# Altium schematic sheet 锁生活.SchDoc
size 381 x 241 mm
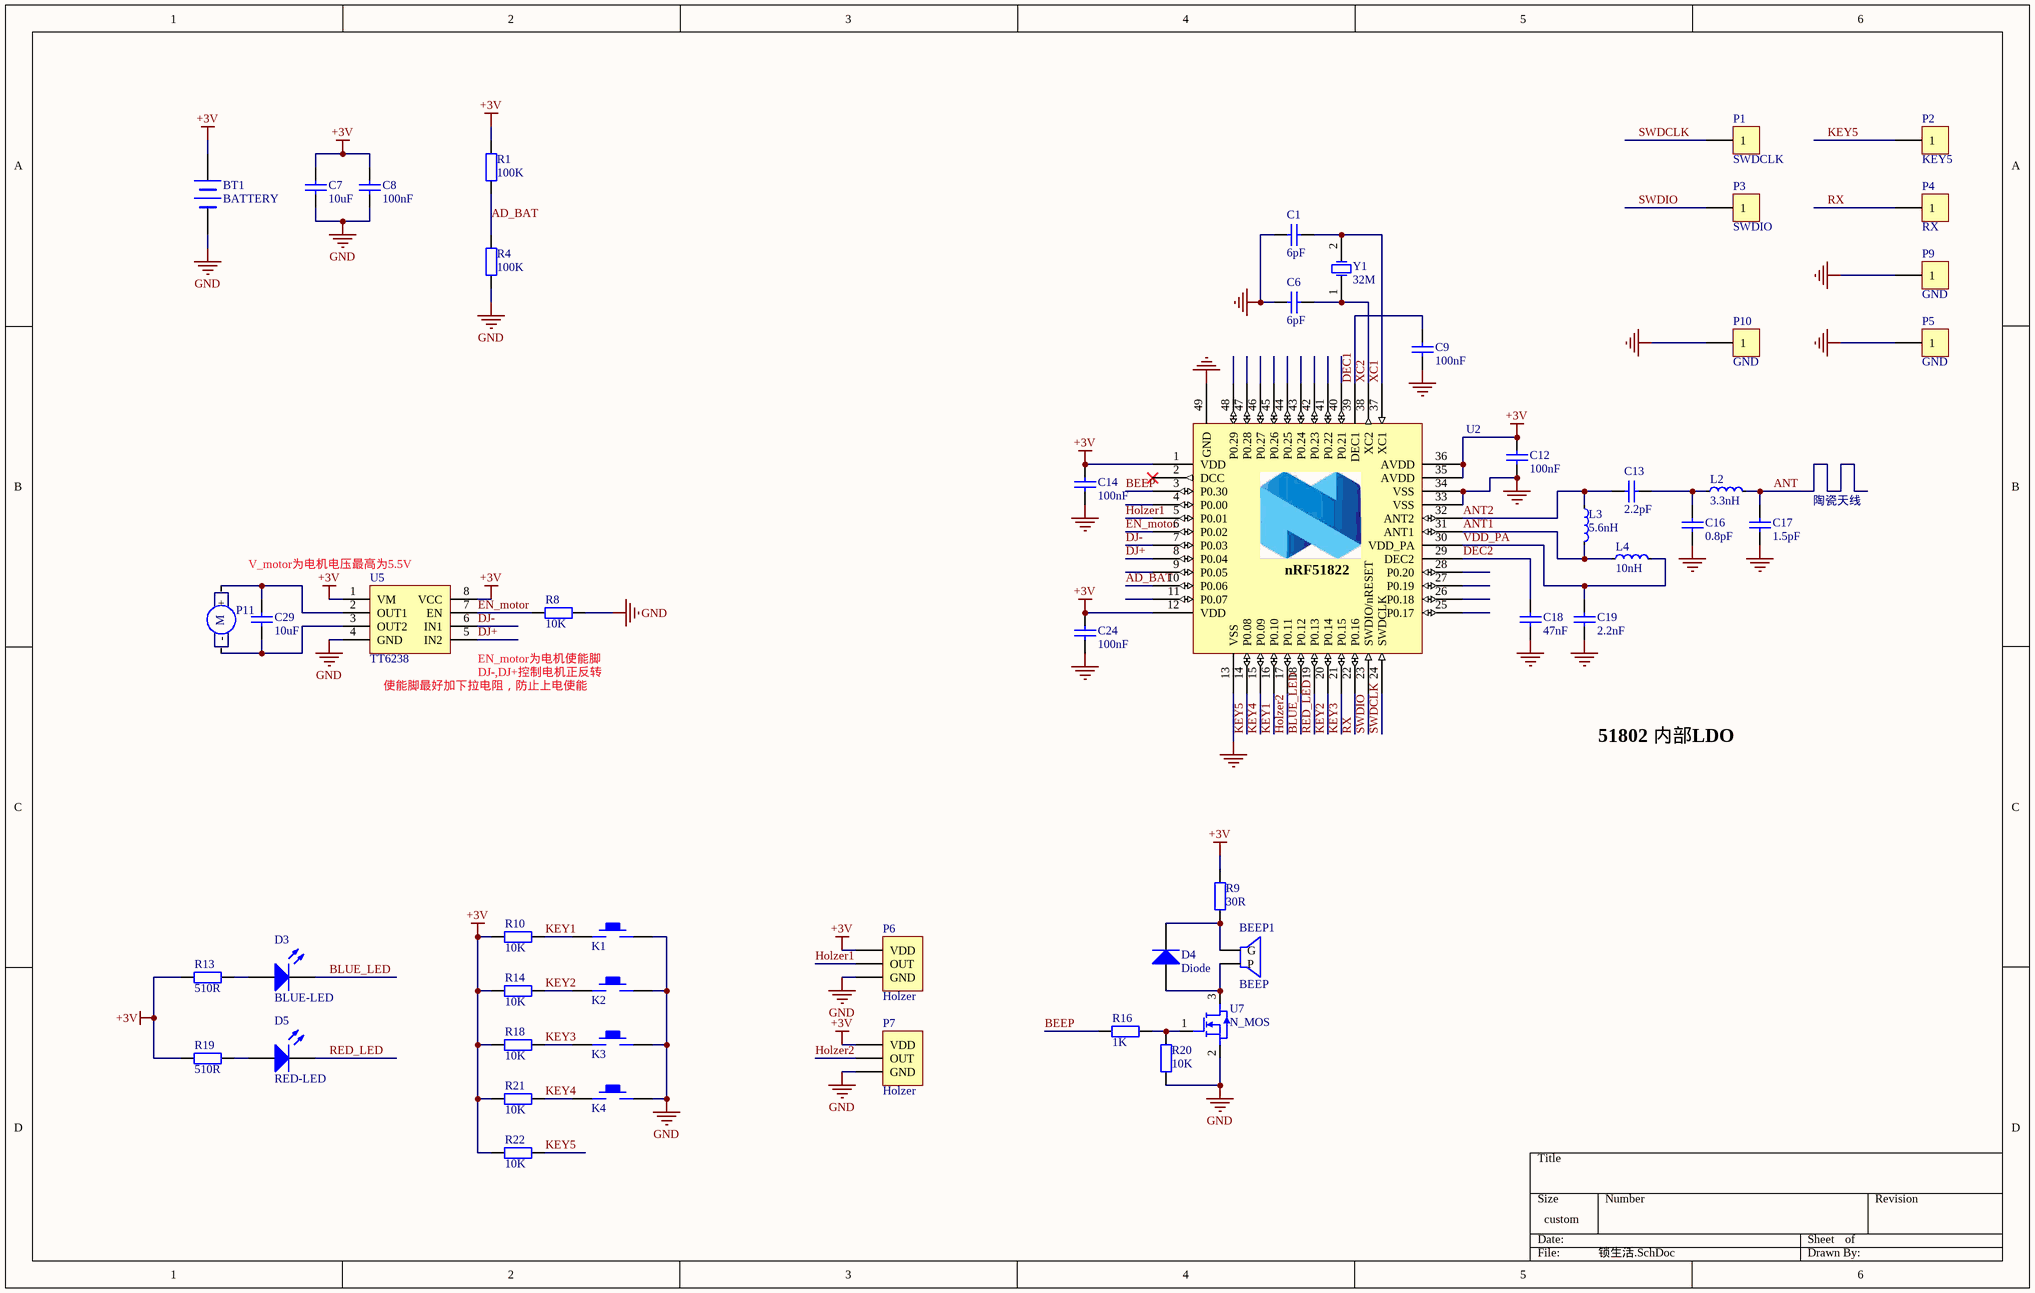
[diagram p0: 锁生活.SchDoc]

## Parts
BEEP1  BEEP  [BELL-φ5]
BT1  BATTERY  [2P-1.0卧贴连接器]
C1  6pF  [0402_C]
C6  6pF  [0402_C]
C7  10uF  [0402_C]
C8  100nF  [0402_C]
C9  100nF  [0402_C]
C12  100nF  [0402_C]
C13  2.2pF  [0402_C]
C14  100nF  [0402_C]
C16  0.8pF  [0402_C]
C17  1.5pF  [0402_C]
C18  47nF  [0402_C]
C19  2.2nF  [0402_C]
C24  100nF  [0402_C]
C29  10uF  [LC-0402_C]
D3  BLUE-LED  [0402_LED]
D4  Diode  [SOD-123F]
D5  RED-LED  [0402_LED]
K1  KEY  [KEY_SMT4x4x1.5]  (value not drawn)
K2  KEY  [KEY_SMT4x4x1.5]  (value not drawn)
K3  KEY  [KEY_SMT4x4x1.5]  (value not drawn)
K4  KEY  [KEY_SMT4x4x1.5]  (value not drawn)
L2  3.3nH  [0402_L]
L3  5.6nH  [0402_L]
L4  10nH  [0402_L]
P1  SWDCLK  [1P]
P2  KEY5  [1P]
P3  SWDIO  [1P]
P4  RX  [1P]
P5  GND  [1P]
P6  Holzer  [Holzer]
P7  Holzer  [SOT23-3]
P9  GND  [1P]
P10  GND  [1P]
P11  Motor  [2P-1.0卧贴连接器]  (value not drawn)
R1  100K  [0402_R]
R4  100K  [0402_R]
R8  10K  [LC-0402_R]
R9  30R  [0402_R]
R10  10K  [LC-0402_R]
R13  510R  [LC-0402_R]
R14  10K  [LC-0402_R]
R16  1K  [0402_R]
R18  10K  [LC-0402_R]
R19  510R  [LC-0402_R]
R20  10K  [0402_R]
R21  10K  [LC-0402_R]
R22  10K  [LC-0402_R]
U2  nRF51822-QFAA  [QFN-48_6x6x04P]  (value not drawn)
U5  TT6238  [DFN-8(2*2)]
U7  N_MOS  [SOT23-3]
WAN1  陶瓷天线  [陶瓷天线]
Y1  32M  [XT-2016]

## Nets
+3V: BT1.1(+) C7.2 C8.2 C12.2 C14.2 C24.2 P6.1(VDD) P7.1(VDD) R1.1 R9.2 R10.1 R13.1 R14.1 R18.1 R19.1 R21.1 R22.2 U2.1(VDD) U2.12(VDD) U2.35(AVDD) U2.36(AVDD) U5.1(VM) U5.8(VCC)
GND: BT1.2(-) C1.1 C6.1 C7.1 C8.1 C9.1 C12.1 C14.1 C16.1 C17.1 C18.1 C19.1 C24.1 K1.2 K2.2 K3.2 K4.2 P5.1 P6.3(GND) P7.3(GND) P9.1 P10.1 R4.1 R8.2 R20.1 U2.13(VSS) U2.33(VSS) U2.34(VSS) U2.49 U5.4(GND) U7.2(S)
AD_BAT: R1.2 R4.2 U2.10(P0.06)
ANT: C17.2 L2.2 WAN1.1
ANT1: L3.2 L4.1 U2.31(ANT1)
ANT2: C13.2 L3.1 U2.32(ANT2)
BEEP: R16.1 U2.3(P0.30)
BLUE_LED: D3.K U2.18(P0.12)
DEC1: C9.2 U2.39(DEC1)
DEC2: C18.2 U2.29(DEC2)
DJ+: U2.8(P0.04) U5.5(IN2)
DJ-: U2.7(P0.03) U5.6(IN1)
EN_motor: R8.1 U2.6(P0.02) U5.7(EN)
Holzer1: P6.2(OUT) U2.5(P0.01)
Holzer2: P7.2(OUT) U2.17(P0.11)
KEY1: K1.1 R10.2 U2.16(P0.10)
KEY2: K2.1 R14.2 U2.20(P0.14)
KEY3: K3.1 R18.2 U2.21(P0.15)
KEY4: K4.1 R21.2 U2.15(P0.09)
KEY5: P2.1 R22.1 U2.14(P0.08)
RED_LED: D5.K U2.19(P0.13)
RX: P4.1 U2.22(P0.16)
SWDCLK: P1.1 U2.24(SWDCLK)
SWDIO: P3.1 U2.23(SWDIO/nRESET)
VDD_PA: C19.2 L4.2 U2.30(VDD_PA)
XC1: C1.2 U2.37(XC1) Y1.2(OSC2)
XC2: C6.2 U2.38(XC2) Y1.1(OSC1)
NetBEEP1_1: BEEP1.1(P) D4.2(A) U7.3(D)
NetBEEP1_2: BEEP1.2(G) D4.1(K) R9.1
NetC13_1: C13.1 C16.2 L2.1
NetC29_1: C29.1 P11.2(-) U5.3(OUT2)
NetC29_2: C29.2 P11.1(+) U5.2(OUT1)
NetD3_A: D3.A R13.2
NetD5_A: D5.A R19.2
NetR16_2: R16.2 R20.2 U7.1(G)

Not connected (* = marked no-connect by the designer): U2 2(DCC)* 4(P0.00) 9(P0.05) 11(P0.07) 25(P0.17) 26(P0.18) 27(P0.19) 28(P0.20) 40(P0.21) 41(P0.22) 42(P0.23) 43(P0.24) 44(P0.25) 45(P0.26) 46(P0.27) 47(P0.28) 48(P0.29); WAN1 2

## Notes on the sheet
- V_motor为电机电压最高为5.5V
- (near U5) 使能脚最好加下拉电阻，防止上电使能
- EN_motor为电机使能脚
- DJ-,DJ+控制电机正反转
- 51802 内部LDO
- (in symbol Motor) M
- (in symbol nRF51822_QFN48) nRF51822

## Library data of the parts
BEEP1 = BEEP: 蜂鸣器
BT1 = BATTERY: 电池
C1 C6-C9 C12-C14 C16-C19 C24 C29 = Cap: Capacitor; Published: 8-Jun-2000; LatestRevisionDate: 17-Jul-2002; LatestRevisionNote: Re-released for DXP Platform.; PackageReference: RAD-0.3; Publisher: Altium Limited; PackageDescription: Radial Cap, Thru-Hole; 2 Leads; 0.3 in Pin Spacing
  C1 C6: Value: 6pF
  C7 C29: Value: 10uF
  C8 C9 C12 C14 C24: Value: 100nF
  C13: Value: 2.2pF
  C16: Value: 0.8pF
  C17: Value: 1.5pF
  C18: Value: 47nF
  C19: Value: 2.2nF
D3 D5 = LED: Typical RED, GREEN, YELLOW, AMBER GaAs LED; Published: 8-Jun-2000; LatestRevisionDate: 17-Jul-2002; LatestRevisionNote: Re-released for DXP Platform.; PackageDocument: Feb-2002; PackageReference: 3.2X1.6X1.1; Publisher: Altium Limited
L2-L4 = L
  L2: Value: 3.3nH
  L3: Value: 5.6nH
  L4: Value: 10nH
P1-P5 P9 P10 = Header 1: Header, 1-Pin; LatestRevisionDate: 17-Jul-2002; LatestRevisionNote: Re-released for DXP Platform.; Publisher: Altium Limited
P11 = Motor: 电机
R1 R4 R8-R10 R13 R14 R16 R18-R22 = Res: Resistor; Published: 8-Jun-2000; LatestRevisionDate: 17-Jul-2002; LatestRevisionNote: Re-released for DXP Platform.; PackageReference: AXIAL-0.4; Publisher: Altium Limited; PackageDescription: Axial Device, Thru-Hole; 2 Leads; 0.4 in Pin Spacing
  R1 R4: Value: 100K
  R8 R10 R14 R18 R20-R22: Value: 10K
  R9: Value: 30R
  R13 R19: Value: 510R
  R16: Value: 1K
U2 = nRF51822_QFN48: Multi-protocol Bluetooth Low Energy and 2.4GHz proprietary system-on-chip; Part Number: nRF51822-Q48-6x6_DCDC; Manufacturer: Nordic Semiconductor; Note: nRF51822 - QFN48 6x6 0.4mm pitch; Artikkelnr Noca: 15079200; Manufacturer Part Number: nRF51822-QFAA; Datasheet: *; Footprint: QFN-48; LatestRevisionDate: 2012-07-10; Pin Count: 48; Publisher: Nordic Semiconductor; Published: 2012-07-08; Value: nRF51822-QFAA; Supplier: Nordic Semiconductor; Supplier part number: *; 2nd source Supplier: *; 2nd source part number: *
U5 = TT6237
Y1 = XTAL: Crystal Oscillator; Published: 8-Jun-2000; LatestRevisionDate: 17-Jul-2002; LatestRevisionNote: Re-released for DXP Platform.; Publisher: Altium Limited; Value: 32M
D4 = Diode: Published: 8-Jun-2000; LatestRevisionDate: 17-Jul-2002; LatestRevisionNote: Re-released for DXP Platform.; PackageDocument: Feb-2002; PackageReference: 3.2X1.6X1.1; Publisher: Altium Limited; Value: Diode
P6 P7 = Holzer: LatestRevisionDate: 17-Jul-2002; LatestRevisionNote: Re-released for DXP Platform.; Publisher: Altium Limited